# EAGLE design W603A (EAGLE 6.6.0)
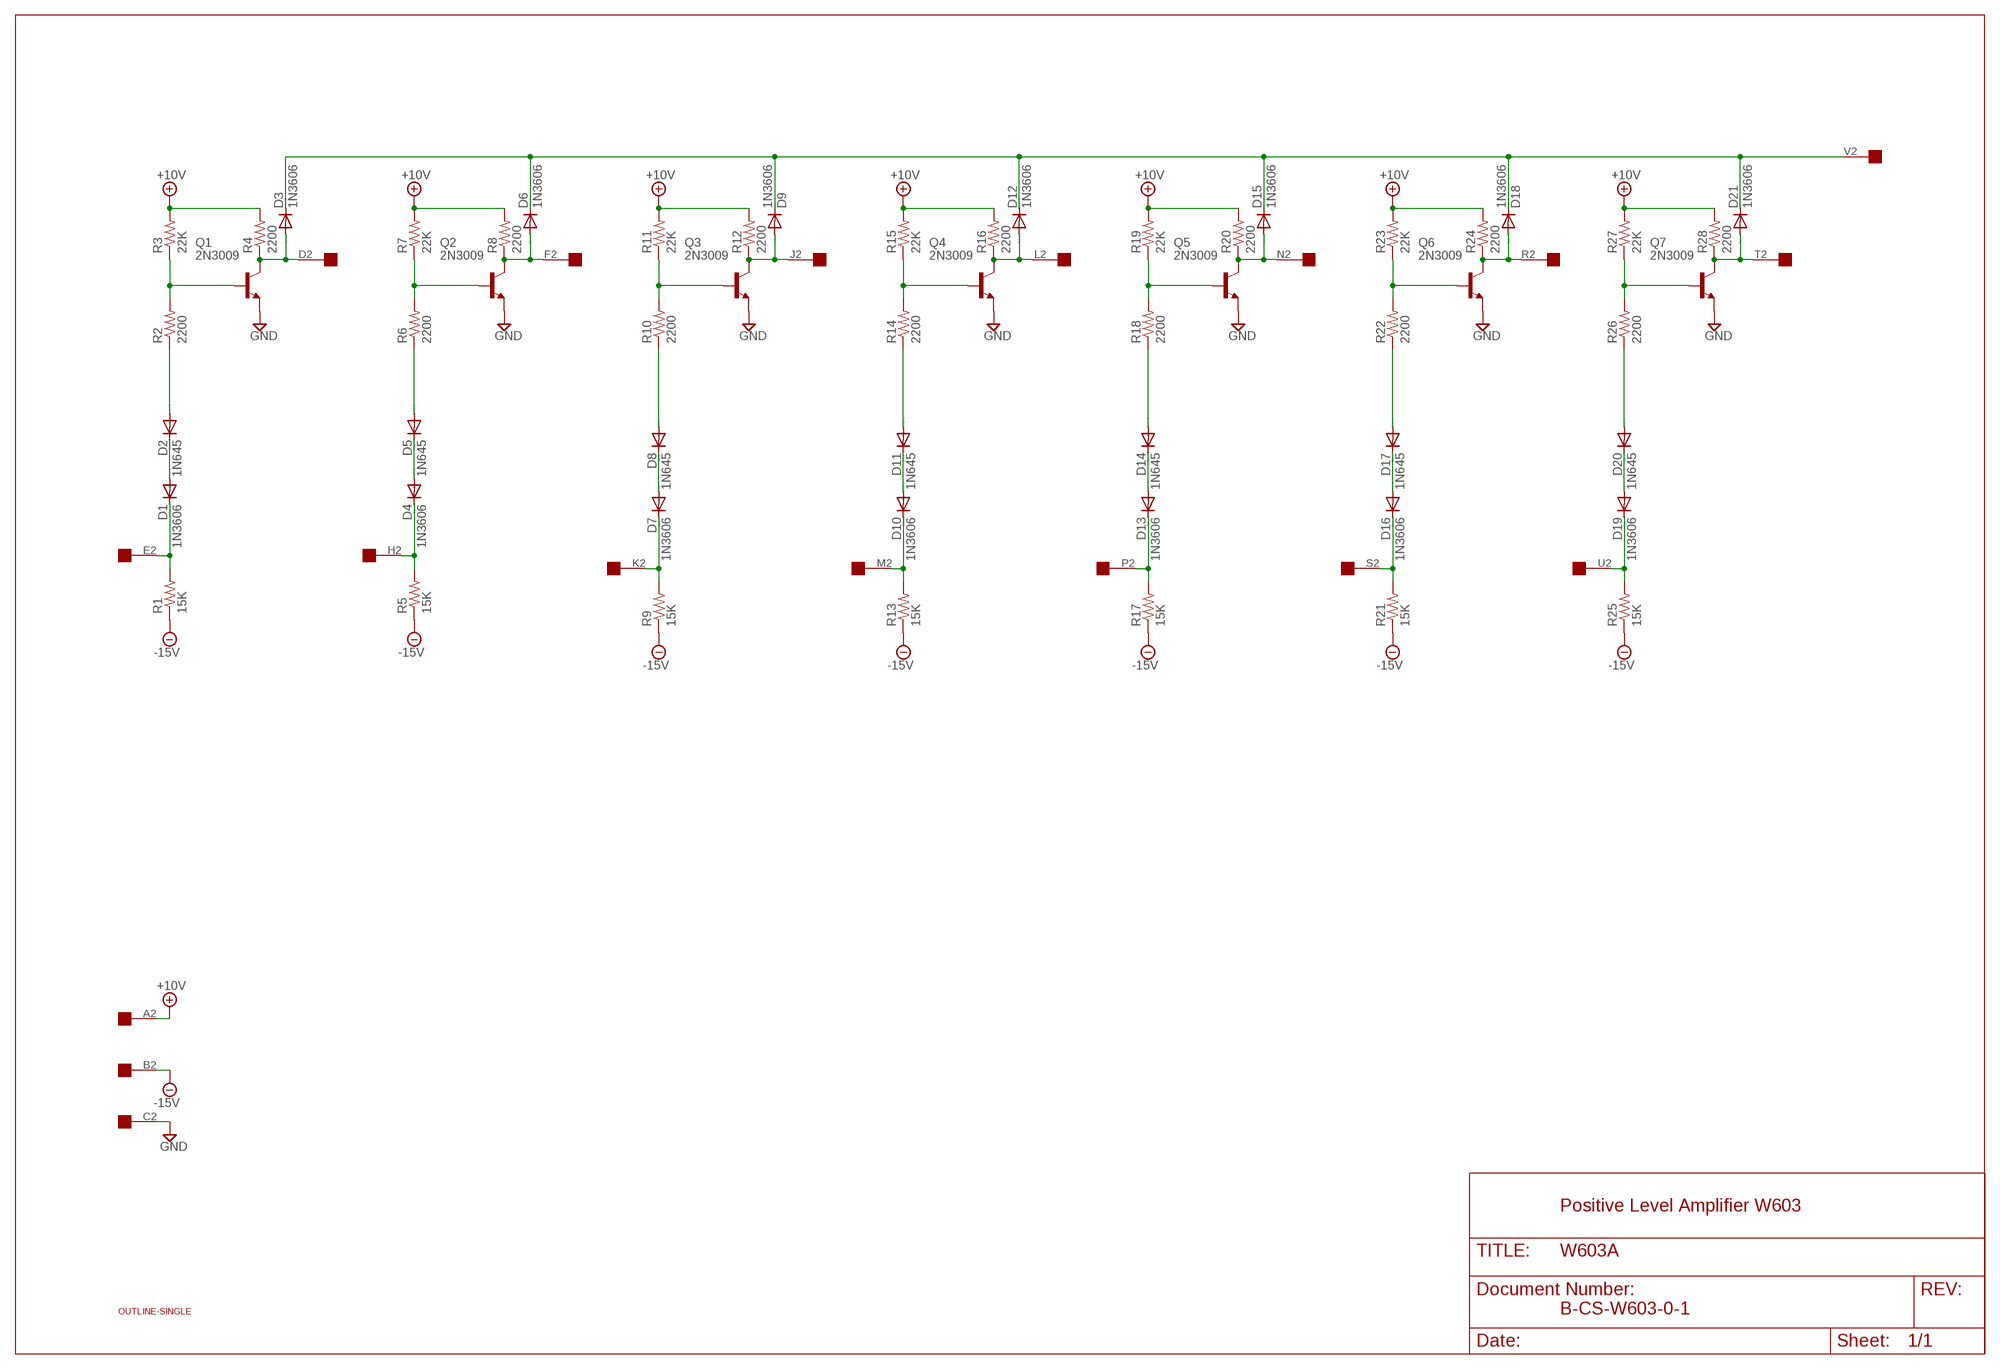
[diagram p0: schematic, sheet 1]

## Parts
D1  1N3606  1N4148DO35-10  [DO35-10]
D2  1N645  1N4148DO35-10  [DO35-10]
D3  1N3606  1N4148DO35-10  [DO35-10]
D4  1N3606  1N4148DO35-10  [DO35-10]
D5  1N645  1N4148DO35-10  [DO35-10]
D6  1N3606  1N4148DO35-10  [DO35-10]
D7  1N3606  1N4148DO35-10  [DO35-10]
D8  1N645  1N4148DO35-10  [DO35-10]
D9  1N3606  1N4148DO35-10  [DO35-10]
D10  1N3606  1N4148DO35-10  [DO35-10]
D11  1N645  1N4148DO35-10  [DO35-10]
D12  1N3606  1N4148DO35-10  [DO35-10]
D13  1N3606  1N4148DO35-10  [DO35-10]
D14  1N645  1N4148DO35-10  [DO35-10]
D15  1N3606  1N4148DO35-10  [DO35-10]
D16  1N3606  1N4148DO35-10  [DO35-10]
D17  1N645  1N4148DO35-10  [DO35-10]
D18  1N3606  1N4148DO35-10  [DO35-10]
D19  1N3606  1N4148DO35-10  [DO35-10]
D20  1N645  1N4148DO35-10  [DO35-10]
D21  1N3606  1N4148DO35-10  [DO35-10]
Q1  2N3009  2N2102  [TO5]
Q2  2N3009  2N2102  [TO5]
Q3  2N3009  2N2102  [TO5]
Q4  2N3009  2N2102  [TO5]
Q5  2N3009  2N2102  [TO5]
Q6  2N3009  2N2102  [TO5]
Q7  2N3009  2N2102  [TO5]
R1  15K  R-US_0207/10  [0207/10]
R2  2200  R-US_0207/10  [0207/10]
R3  22K  R-US_0207/10  [0207/10]
R4  2200  R-US_0207/10  [0207/10]
R5  15K  R-US_0207/10  [0207/10]
R6  2200  R-US_0207/10  [0207/10]
R7  22K  R-US_0207/10  [0207/10]
R8  2200  R-US_0207/10  [0207/10]
R9  15K  R-US_0207/10  [0207/10]
R10  2200  R-US_0207/10  [0207/10]
R11  22K  R-US_0207/10  [0207/10]
R12  2200  R-US_0207/10  [0207/10]
R13  15K  R-US_0207/10  [0207/10]
R14  2200  R-US_0207/10  [0207/10]
R15  22K  R-US_0207/10  [0207/10]
R16  2200  R-US_0207/10  [0207/10]
R17  15K  R-US_0207/10  [0207/10]
R18  2200  R-US_0207/10  [0207/10]
R19  22K  R-US_0207/10  [0207/10]
R20  2200  R-US_0207/10  [0207/10]
R21  15K  R-US_0207/10  [0207/10]
R22  2200  R-US_0207/10  [0207/10]
R23  22K  R-US_0207/10  [0207/10]
R24  2200  R-US_0207/10  [0207/10]
R25  15K  R-US_0207/10  [0207/10]
R26  2200  R-US_0207/10  [0207/10]
R27  22K  R-US_0207/10  [0207/10]
R28  2200  R-US_0207/10  [0207/10]
U$1  OUTLINE-SINGLE  [SINGLE]
U$2  EDGE-1  [EDGE-CON1]

## Nets
+10V: R3.2 R4.2 R7.2 R8.2 R11.2 R12.2 R15.2 R16.2 R19.2 R20.2 R23.2 R24.2 R27.2 R28.2 U$2.A2
-15V: R1.1 R5.1 R9.1 R13.1 R17.1 R21.1 R25.1 U$2.B2
GND: Q1.1(E) Q2.1(E) Q3.1(E) Q4.1(E) Q5.1(E) Q6.1(E) Q7.1(E) U$2.C2
N$1: D1.C R1.2 U$2.E2
N$3: D1.A D2.C
N$4: D2.A R2.1
N$5: Q1.2(B) R2.2 R3.1
N$6: D3.A Q1.3(C) R4.1 U$2.D2
N$7: D4.C R5.2 U$2.H2
N$9: D4.A D5.C
N$10: D5.A R6.1
N$11: Q2.2(B) R6.2 R7.1
N$12: D6.A Q2.3(C) R8.1 U$2.F2
N$13: D7.C R9.2 U$2.K2
N$15: D7.A D8.C
N$16: D8.A R10.1
N$17: Q3.2(B) R10.2 R11.1
N$18: D9.A Q3.3(C) R12.1 U$2.J2
N$19: D3.C D6.C D9.C D12.C D15.C D18.C D21.C U$2.V2
N$20: D10.C R13.2 U$2.M2
N$22: D10.A D11.C
N$23: D11.A R14.1
N$24: Q4.2(B) R14.2 R15.1
N$25: D12.A Q4.3(C) R16.1 U$2.L2
N$26: D13.C R17.2 U$2.P2
N$27: D13.A D14.C
N$28: D14.A R18.1
N$29: Q5.2(B) R18.2 R19.1
N$30: D15.A Q5.3(C) R20.1 U$2.N2
N$32: D16.C R21.2 U$2.S2
N$34: D16.A D17.C
N$35: D17.A R22.1
N$36: Q6.2(B) R22.2 R23.1
N$37: D18.A Q6.3(C) R24.1 U$2.R2
N$38: D19.C R25.2 U$2.U2
N$40: D19.A D20.C
N$41: D20.A R26.1
N$42: Q7.2(B) R26.2 R27.1
N$43: D21.A Q7.3(C) R28.1 U$2.T2

## Notes on the sheet
- Positive Level Amplifier W603
- B-CS-W603-0-1

## Library data of the parts
D1-D21 = diode:1N4148: DIODE high speed (Philips)
Q1-Q7 = transistor:2N2102: NPN TRANSISTOR
R1-R28 = rcl:R-US_: RESISTOR, American symbol
U$1 = dec-con:OUTLINE-*: Board outlines for DEC boards.
U$2 = dec-con:EDGE-1: Single-Sided DEC Edge Connector -- (side 2)

## Board
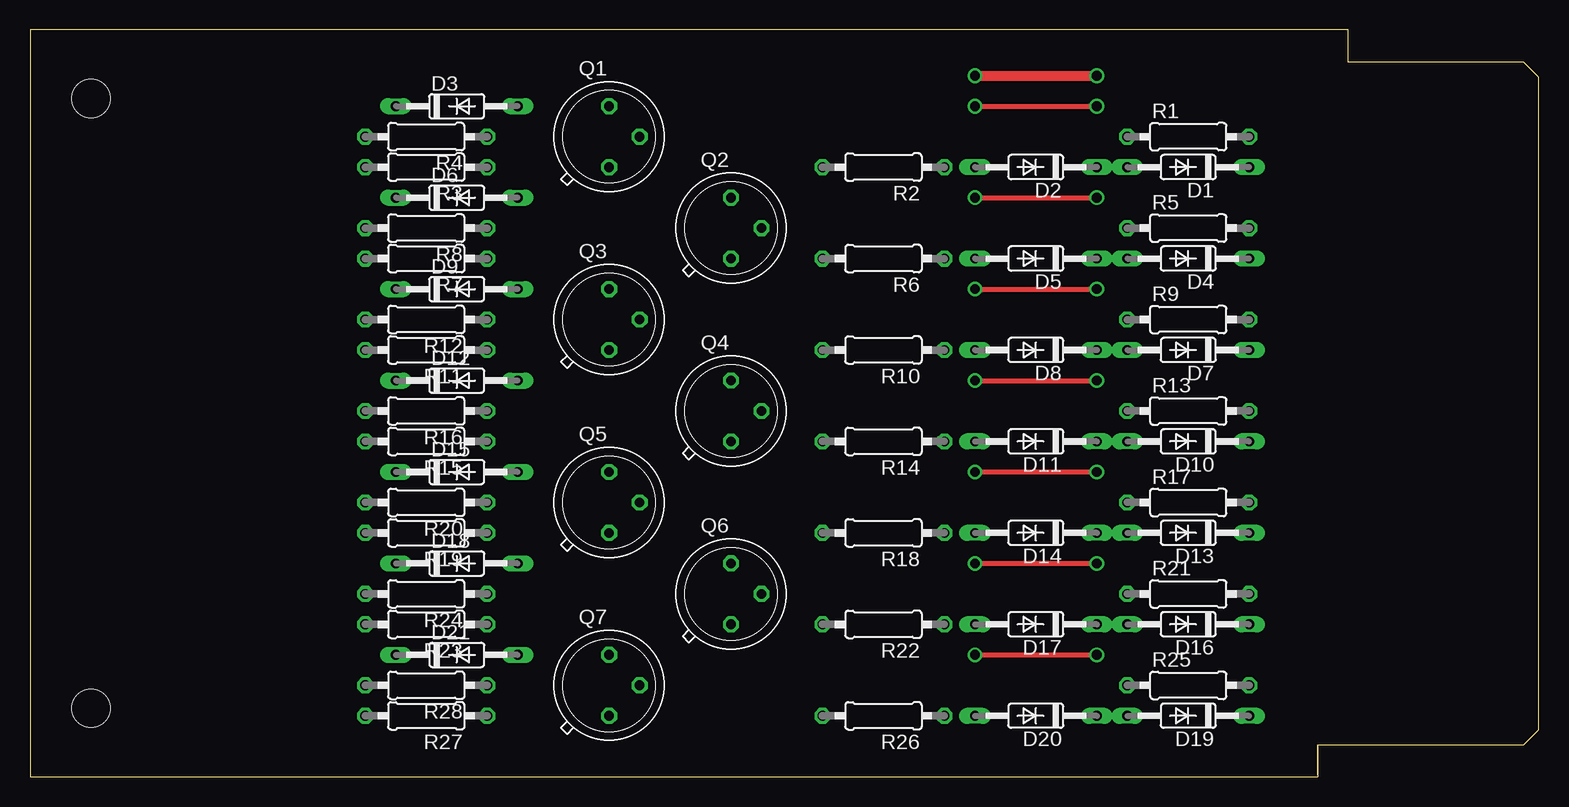
[diagram p1: board, top side]
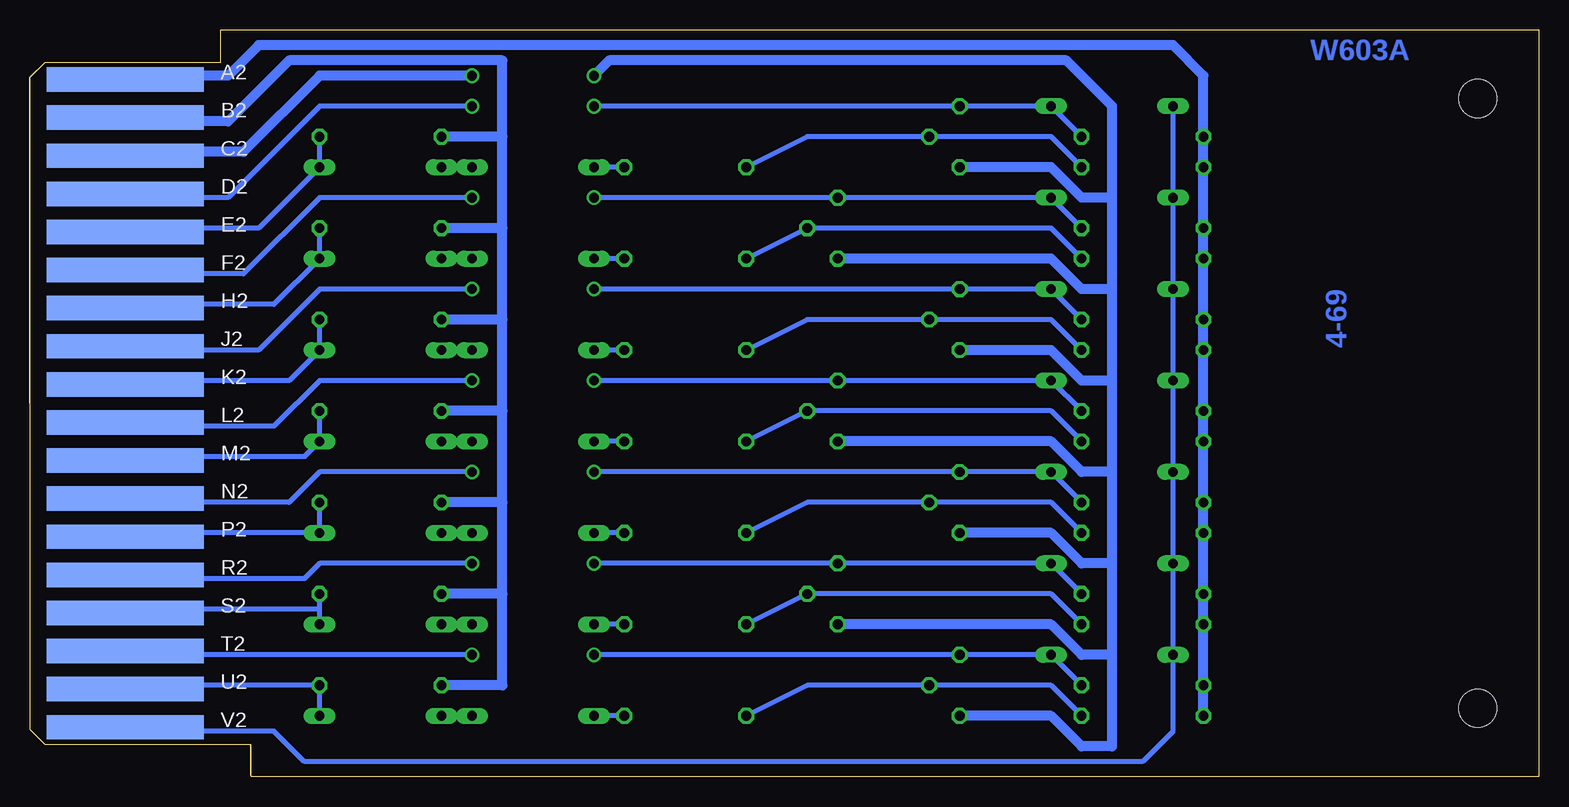
[diagram p2: board, bottom side, seen from below]

Size 125.73 x 62.23 mm. Coordinates in mm from the lower left corner, seen from the top.
Copper layers (1+16): Top 0.035mm / dielectric 1.5mm / Bottom 0.035mm
Design rules "16mils": minimum track width 16mil, minimum drill 32mil, track to track 15mil, track to pad 10mil, pad to pad 10mil, via to via 10mil, smd to smd 10mil, copper to edge 13mil, drill to drill 10mil, minimum pad ring 10mil, minimum via ring 8mil, stop-mask expansion 0mil, vias tented up to drill 0mil, thermal gap 10mil

### Footprints (pad centres in the part's own frame; a part is rotated, then mirrored left to right if it is on the bottom)
DO35-10 = drill 0.813 long: A 5.08,0; C -5.08,0
TO5 = drill 0.813 octagon: 1 0,-2.54; 2 2.54,0; 3 0,2.54
0207/10 = drill 0.813 octagon: 1 -5.08,0; 2 5.08,0
SINGLE = hole 3.175: 120.65,56.515; 120.65,5.715
EDGE-CON1 = smd 13.106 x 2.032 bottom: A2 7.938,4.128; B2 7.938,7.303; C2 7.938,10.477; D2 7.938,13.652; E2 7.938,16.828; F2 7.938,20.003; H2 7.938,23.177; J2 7.938,26.352; K2 7.938,29.527; L2 7.938,32.703; M2 7.938,35.877; N2 7.938,39.053; P2 7.938,42.227; R2 7.938,45.403; S2 7.938,48.578; T2 7.938,51.752; U2 7.938,54.928; V2 7.938,58.102

### Placement (x,y rotation side)
D1  96.52,50.8 180 top
D2  83.82,50.8 180 top
D3  35.56,55.88 0 top
D4  96.52,43.18 180 top
D5  83.82,43.18 180 top
D6  35.56,48.26 0 top
D7  96.52,35.56 180 top
D8  83.82,35.56 180 top
D9  35.56,40.64 0 top
D10  96.52,27.94 180 top
D11  83.82,27.94 180 top
D12  35.56,33.02 0 top
D13  96.52,20.32 180 top
D14  83.82,20.32 180 top
D15  35.56,25.4 0 top
D16  96.52,12.7 180 top
D17  83.82,12.7 180 top
D18  35.56,17.78 0 top
D19  96.52,5.08 180 top
D20  83.82,5.08 180 top
D21  35.56,10.16 0 top
Q1  48.26,53.34 0 top
Q2  58.42,45.72 0 top
Q3  48.26,38.1 0 top
Q4  58.42,30.48 0 top
Q5  48.26,22.86 0 top
Q6  58.42,15.24 0 top
Q7  48.26,7.62 0 top
R1  96.52,53.34 0 top
R2  71.12,50.8 180 top
R3  33.02,50.8 180 top
R4  33.02,53.34 180 top
R5  96.52,45.72 0 top
R6  71.12,43.18 180 top
R7  33.02,43.18 180 top
R8  33.02,45.72 180 top
R9  96.52,38.1 0 top
R10  71.12,35.56 180 top
R11  33.02,35.56 180 top
R12  33.02,38.1 180 top
R13  96.52,30.48 0 top
R14  71.12,27.94 180 top
R15  33.02,27.94 180 top
R16  33.02,30.48 180 top
R17  96.52,22.86 0 top
R18  71.12,20.32 180 top
R19  33.02,20.32 180 top
R20  33.02,22.86 180 top
R21  96.52,15.24 0 top
R22  71.12,12.7 180 top
R23  33.02,12.7 180 top
R24  33.02,15.24 180 top
R25  96.52,7.62 0 top
R26  71.12,5.08 180 top
R27  33.02,5.08 180 top
R28  33.02,7.62 180 top
U$1  125.73,62.23 180 top
U$2  125.73,62.23 180 top

### Tracks (layer width: path | path; a pad name or v marks a point on that pad's centre or on a via)
+10V
  Bottom 0.813: U$2.A2 116.84,58.04 116.84,58.42 109.22,58.42 106.68,60.96 30.48,60.96 27.94,58.42 R4.2 R3.2 R8.2 R7.2 R12.2 R11.2 R16.2 R15.2 R20.2 R19.2 R24.2 R23.2 R28.2 R27.2
-15V
  Bottom 0.813: U$2.B2 117.13,54.9 116.84,54.61 109.22,54.61 104.14,59.69 86.36,59.69 86.36,53.34 | 86.36,15.24 86.36,7.62 R25.1 | 86.36,15.24 86.36,22.86 | 86.36,22.86 86.36,30.48 | 86.36,30.48 86.36,38.1 | 86.36,38.1 86.36,45.72 | 86.36,45.72 86.36,53.34 | 86.36,15.24 R21.1 | 86.36,22.86 R17.1 | 86.36,30.48 R13.1 | 86.36,38.1 R9.1 | 86.36,45.72 R5.1 | 86.36,53.34 R1.1
GND  (via drill 0.81, 0.81 pad 0.81)
  Top 0.813: v78.74,58.42 v88.9,58.42
  Bottom 0.813: U$2.C2 117.17,51.74 116.84,52.07 107.95,52.07 101.6,58.42 v88.9,58.42 | v78.74,58.42 77.47,59.69 39.37,59.69 35.56,55.88 35.56,48.26 | 35.56,10.16 35.56,2.54 38.1,2.54 40.64,5.08 Q7.1 | 35.56,10.16 35.56,17.78 | 35.56,17.78 35.56,25.4 | 35.56,25.4 35.56,33.02 | 35.56,33.02 35.56,40.64 | 35.56,40.64 35.56,48.26 | 35.56,10.16 38.1,10.16 40.64,12.7 Q6.1 | 35.56,17.78 38.1,17.78 40.64,20.32 Q5.1 | 35.56,25.4 38.1,25.4 40.64,27.94 Q4.1 | 35.56,33.02 38.1,33.02 40.64,35.56 Q3.1 | 35.56,40.64 38.1,40.64 40.64,43.18 Q2.1 | 35.56,48.26 38.1,48.26 40.64,50.8 Q1.1
N$1
  Bottom 0.406: U$2.E2 116.84,45.72 106.68,45.72 D1.C R1.2
N$3
  Bottom 0.406: D2.C D1.A
N$4
  Bottom 0.406: R2.1 D2.A
N$5
  Bottom 0.406: R2.2 60.96,53.34 Q1.2 40.64,53.34 R3.1
N$6  (via drill 0.81 pad 0.81)
  Top 0.406: v78.74,55.88 v88.9,55.88
  Bottom 0.406: U$2.D2 117.14,48.56 116.84,48.26 109.22,48.26 101.6,55.88 v88.9,55.88 | v78.74,55.88 Q1.3 D3.A R4.1
N$7
  Bottom 0.406: U$2.H2 116.84,39.37 105.41,39.37 D4.C R5.2
N$9
  Bottom 0.406: D5.C D4.A
N$10
  Bottom 0.406: R6.1 D5.A
N$11
  Bottom 0.406: R7.1 40.64,45.72 Q2.2 R6.2
N$12  (via drill 0.81 pad 0.81)
  Top 0.406: v78.74,48.26 v88.9,48.26
  Bottom 0.406: R8.1 D6.A Q2.3 v78.74,48.26 | U$2.F2 117.12,42.19 116.84,41.91 107.95,41.91 101.6,48.26 v88.9,48.26
N$13
  Bottom 0.406: U$2.K2 116.84,33.02 104.14,33.02 D7.C R9.2
N$15
  Bottom 0.406: D8.C D7.A
N$16
  Bottom 0.406: R10.1 D8.A
N$17
  Bottom 0.406: R10.2 60.96,38.1 Q3.2 40.64,38.1 R11.1
N$18  (via drill 0.81 pad 0.81)
  Top 0.406: v78.74,40.64 v88.9,40.64
  Bottom 0.406: R12.1 D9.A Q3.3 v78.74,40.64 | U$2.J2 117.17,35.89 116.84,35.56 106.68,35.56 101.6,40.64 v88.9,40.64
N$19
  Bottom 0.406: D3.C D6.C D9.C D12.C D15.C D18.C D21.C 30.48,3.81 33.02,1.27 102.87,1.27 105.41,3.81 116.84,3.81 U$2.V2
N$20
  Bottom 0.406: U$2.M2 116.84,26.67 102.87,26.67 D10.C R13.2
N$22
  Bottom 0.406: D11.C D10.A
N$23
  Bottom 0.406: R14.1 D11.A
N$24
  Bottom 0.406: R15.1 40.64,30.48 Q4.2 R14.2
N$25  (via drill 0.81 pad 0.81)
  Top 0.406: v78.74,33.02 v88.9,33.02
  Bottom 0.406: D12.A R16.1 D12.A | D12.A Q4.3 v78.74,33.02 | U$2.L2 117.17,29.54 116.84,29.21 105.41,29.21 101.6,33.02 v88.9,33.02
N$26
  Bottom 0.406: U$2.P2 116.84,20.32 D13.C R17.2
N$27
  Bottom 0.406: D14.C D13.A
N$28
  Bottom 0.406: R18.1 D14.A
N$29
  Bottom 0.406: R19.1 40.64,22.86 Q5.2 60.96,22.86 R18.2
N$30  (via drill 0.81 pad 0.81)
  Top 0.406: v78.74,25.4 v88.9,25.4
  Bottom 0.406: R20.1 D15.A Q5.3 v78.74,25.4 | U$2.N2 117.17,23.19 116.84,22.86 104.14,22.86 101.6,25.4 v88.9,25.4
N$32
  Bottom 0.406: U$2.S2 116.84,13.97 101.6,13.97 | D16.C 101.6,13.97 | 101.6,13.97 R21.2
N$34
  Bottom 0.406: D17.C D16.A
N$35
  Bottom 0.406: R22.1 D17.A
N$36
  Bottom 0.406: R23.1 40.64,15.24 Q6.2 R22.2
N$37  (via drill 0.81 pad 0.81)
  Top 0.406: v78.74,17.78 v88.9,17.78
  Bottom 0.406: R24.1 D18.A Q6.3 v78.74,17.78 | U$2.R2 116.84,16.51 102.87,16.51 101.6,17.78 v88.9,17.78
N$38
  Bottom 0.406: U$2.U2 116.84,7.62 R25.2 D19.C
N$40
  Bottom 0.406: D20.C D19.A
N$41
  Bottom 0.406: R26.1 D20.A
N$42
  Bottom 0.406: R27.1 40.64,7.62 Q7.2 60.96,7.62 R26.2
N$43  (via drill 0.81 pad 0.81)
  Top 0.406: v78.74,10.16 v88.9,10.16
  Bottom 0.406: R28.1 D21.A Q7.3 v78.74,10.16 | U$2.T2 117.17,10.49 116.84,10.16 v88.9,10.16

### Text on the board
Bottom: W603A | 4-69